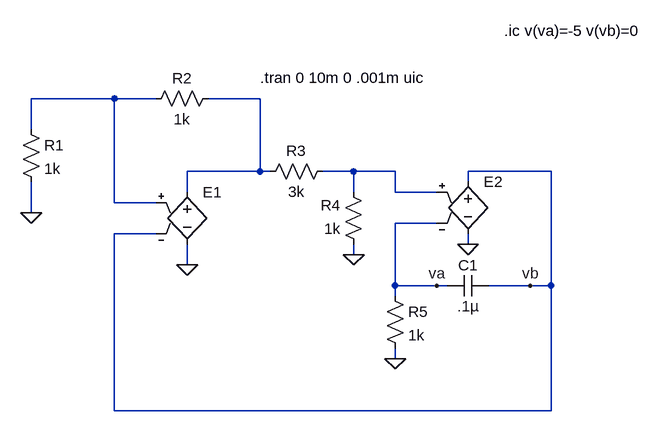
[diagram p0: schematic triangular3.asc]
triangular3.asc, the LTspice schematic file:
Version 4
SHEET 1 1748 680
WIRE 160 16 32 16
WIRE 224 16 160 16
WIRE 384 16 304 16
WIRE 32 64 32 16
WIRE 384 128 384 16
WIRE 384 128 272 128
WIRE 400 128 384 128
WIRE 528 128 480 128
WIRE 592 128 528 128
WIRE 832 128 704 128
WIRE 704 144 704 128
WIRE 272 160 272 128
WIRE 528 160 528 128
WIRE 592 160 592 128
WIRE 656 160 592 160
WIRE 160 176 160 16
WIRE 224 176 160 176
WIRE 32 192 32 144
WIRE 656 208 592 208
WIRE 224 224 160 224
WIRE 704 240 704 224
WIRE 528 256 528 240
WIRE 272 272 272 240
WIRE 592 304 592 208
WIRE 656 304 592 304
WIRE 672 304 656 304
WIRE 800 304 736 304
WIRE 832 304 832 128
WIRE 832 304 800 304
WIRE 592 320 592 304
WIRE 592 416 592 400
WIRE 160 496 160 224
WIRE 832 496 832 304
WIRE 832 496 160 496
FLAG 32 192 0
FLAG 272 272 0
FLAG 528 256 0
FLAG 704 240 0
FLAG 592 416 0
FLAG 656 304 va
FLAG 800 304 vb
SYMBOL e 272 144 R0
WINDOW 3 24 96 Invisible 2
SYMATTR Value table=(-100,-12)(-50u,-12)(50u,12)(100,12)
SYMATTR InstName E1
SYMBOL e 704 128 R0
WINDOW 3 24 96 Invisible 2
SYMATTR Value table=(-100,-12)(-50u,-12)(50u,12)(100,12)
SYMATTR InstName E2
SYMBOL res 16 48 R0
SYMATTR InstName R1
SYMATTR Value 1k
SYMBOL res 320 0 R90
WINDOW 0 0 56 VBottom 2
WINDOW 3 32 56 VTop 2
SYMATTR InstName R2
SYMATTR Value 1k
SYMBOL res 496 112 R90
WINDOW 0 0 56 VBottom 2
WINDOW 3 32 56 VTop 2
SYMATTR InstName R3
SYMATTR Value 3k
SYMBOL res 544 256 R180
WINDOW 0 36 76 Left 2
WINDOW 3 36 40 Left 2
SYMATTR InstName R4
SYMATTR Value 1k
SYMBOL res 576 304 R0
SYMATTR InstName R5
SYMATTR Value 1k
SYMBOL cap 736 288 R90
WINDOW 0 0 32 VBottom 2
WINDOW 3 32 32 VTop 2
SYMATTR InstName C1
SYMATTR Value .1µ
TEXT 384 -16 Left 2 !.tran 0 10m 0 .001m uic
TEXT 760 -88 Left 2 !.ic v(va)=-5 v(vb)=0

The netlist it stands for:
* triangular3.asc
E1 N002 0 N001 vb table=(-100,-12)(-50u,-12)(50u,12)(100,12)
E2 vb 0 N003 va table=(-100,-12)(-50u,-12)(50u,12)(100,12)
R1 N001 0 1k
R2 N002 N001 1k
R3 N003 N002 3k
R4 0 N003 1k
R5 va 0 1k
C1 vb va .1µ
.tran 0 10m 0 .001m uic
.ic v(va)=-5 v(vb)=0
.backanno
.end